# EAGLE schematic 1460-0 (EAGLE 6.0)
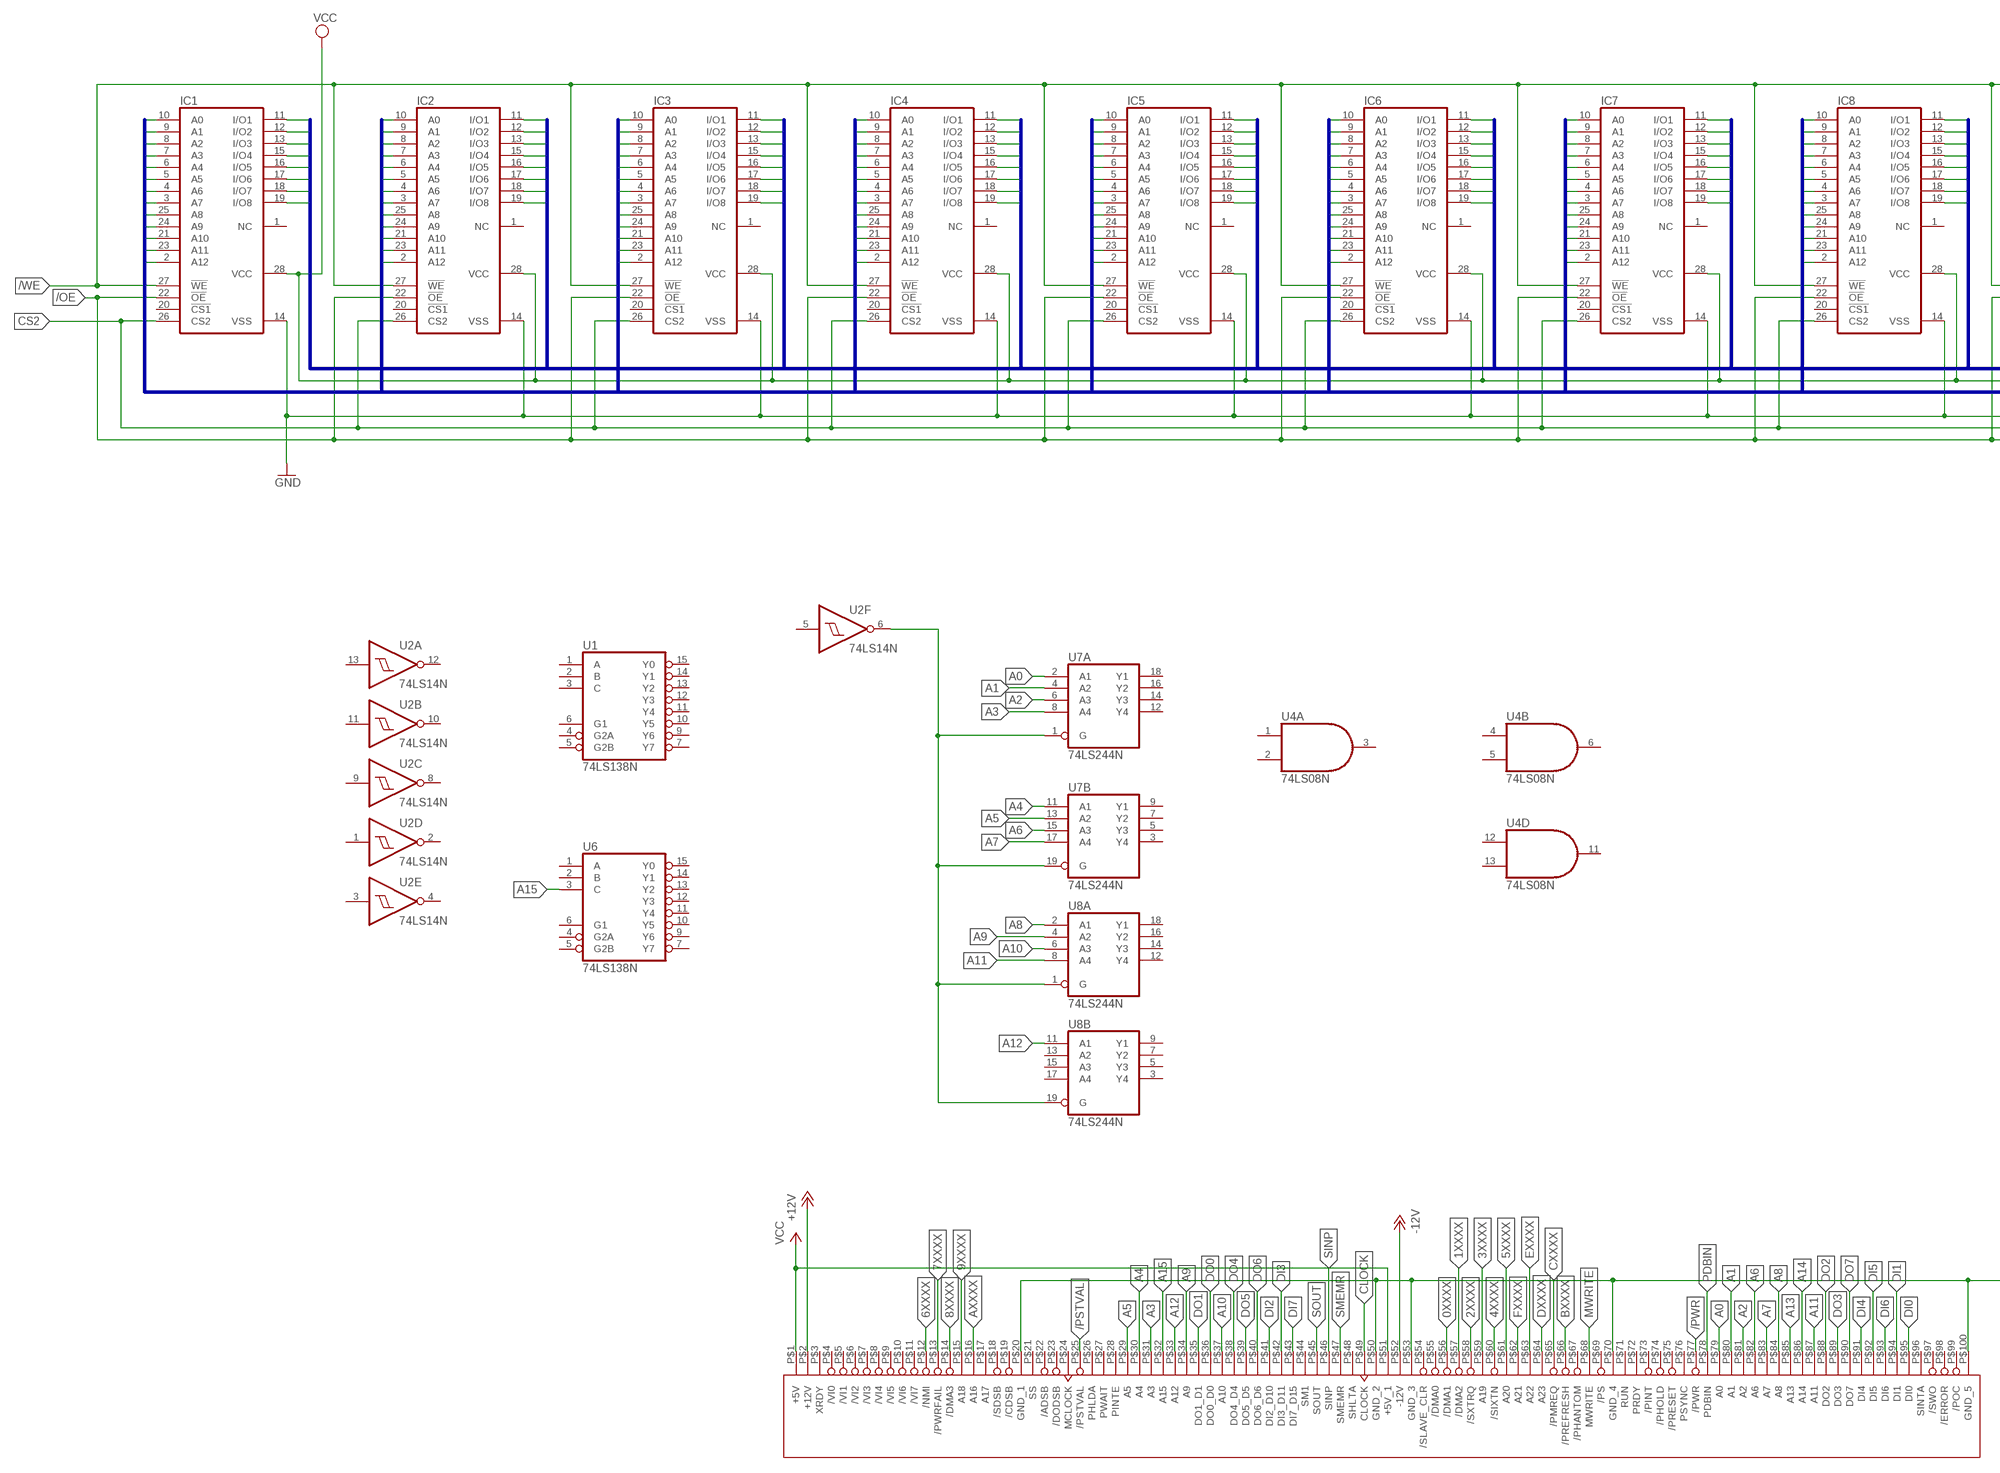
[diagram p0: schematic, sheet 1, part 1 of 2]
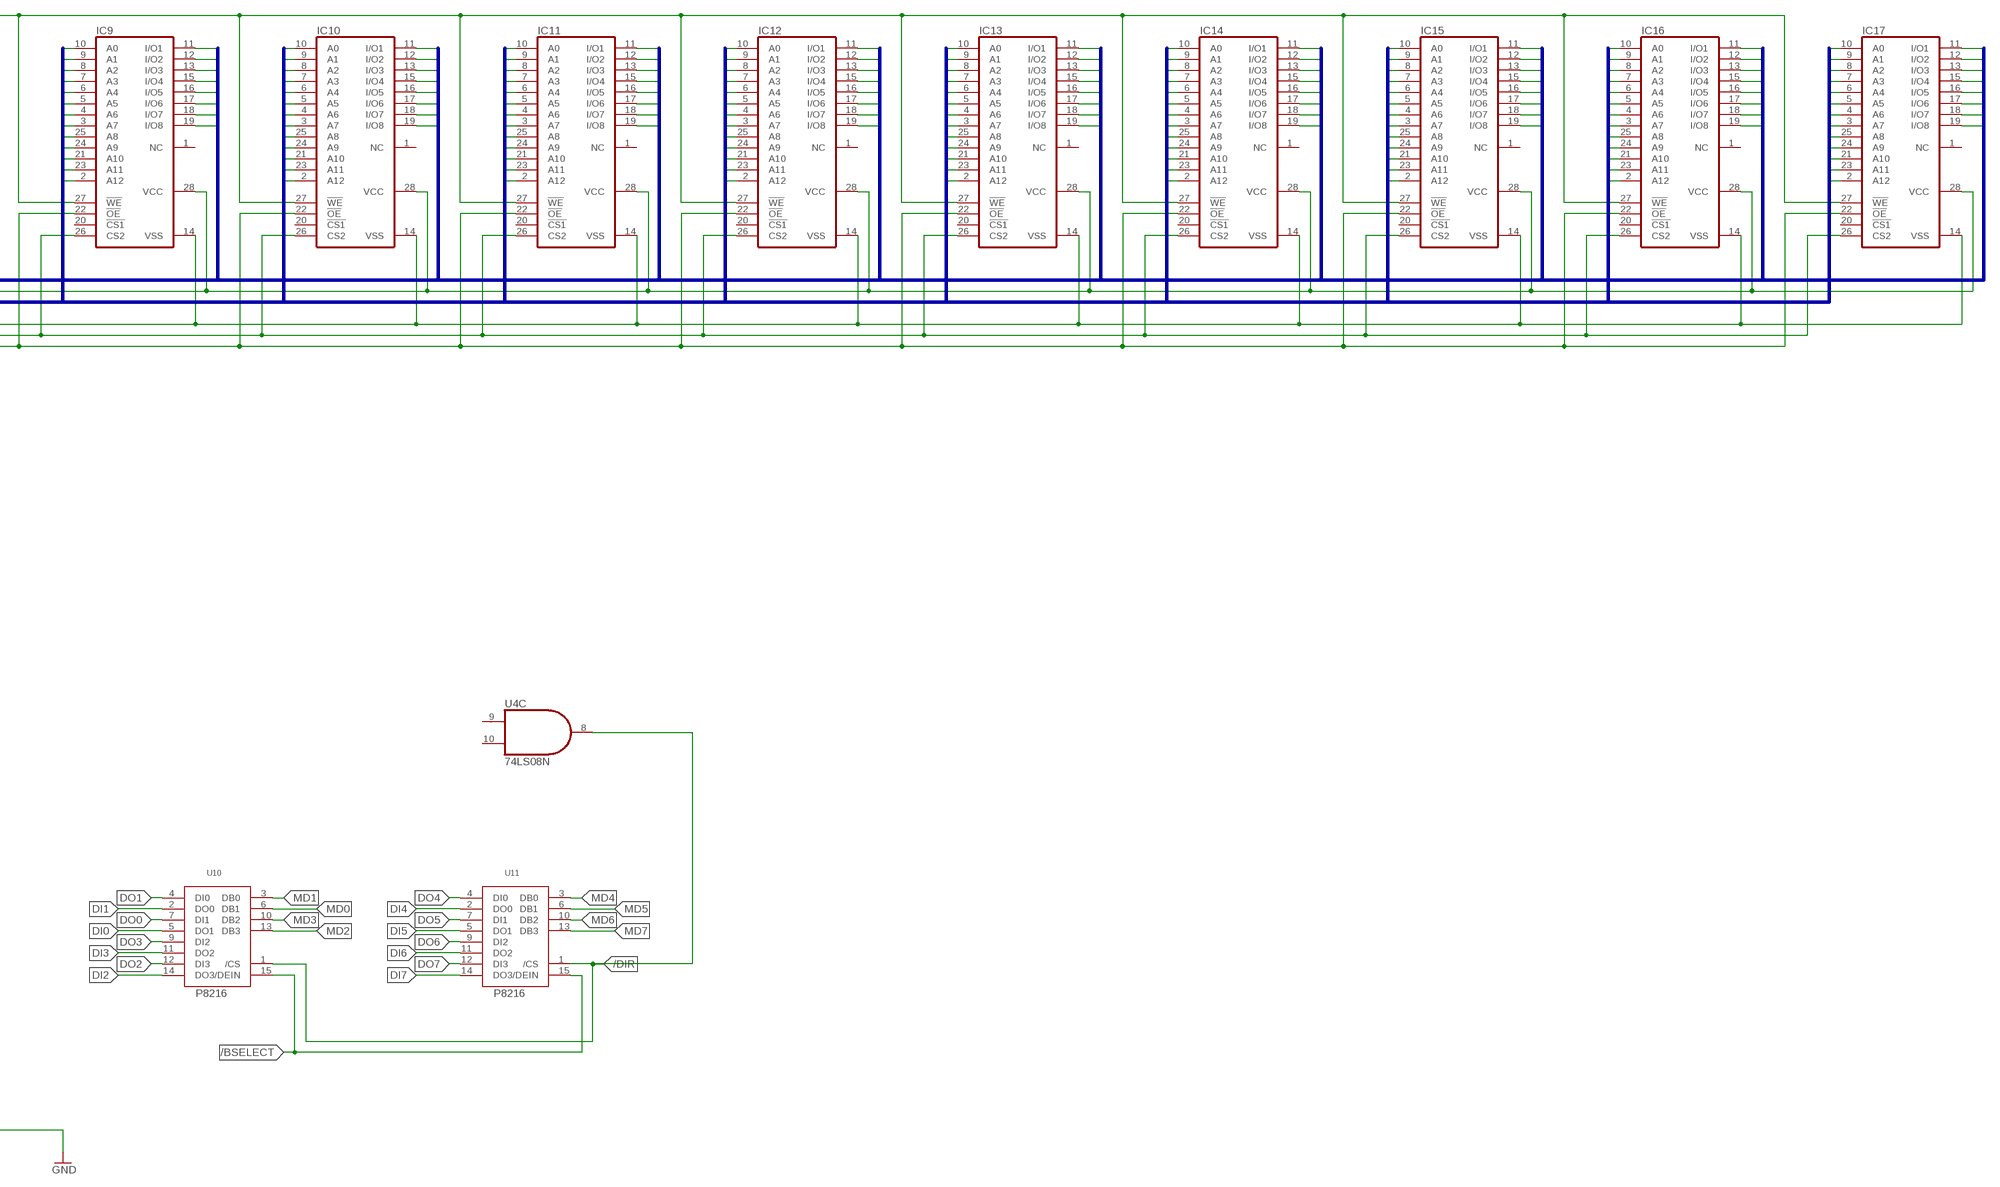
[diagram p1: schematic, sheet 1, part 2 of 2]

## Parts
IC1  6264A  [DIL28-6]
IC2  6264A  [DIL28-6]
IC3  6264A  [DIL28-6]
IC4  6264A  [DIL28-6]
IC5  6264A  [DIL28-6]
IC6  6264A  [DIL28-6]
IC7  6264A  [DIL28-6]
IC8  6264A  [DIL28-6]
IC9  6264A  [DIL28-6]
IC10  6264A  [DIL28-6]
IC11  6264A  [DIL28-6]
IC12  6264A  [DIL28-6]
IC13  6264A  [DIL28-6]
IC14  6264A  [DIL28-6]
IC15  6264A  [DIL28-6]
IC16  6264A  [DIL28-6]
IC17  6264A  [DIL28-6]
U1  74LS138N  [DIL16]
U2  74LS14N  [DIL14]
U4  74LS08N  [DIL14]
U6  74LS138N  [DIL16]
U7  74LS244N  [DIL20]
U8  74LS244N  [DIL20]
U10  P8216  [DIL16]
U11  P8216  [DIL16]
U$1  S100_MALE  [S100_MALE]

## Nets
+12V: U$1.P$2(+12V)
-12V: U$1.P$52(-12V)
/BSELECT: U10.15(/DEIN) U11.15(/DEIN)
/DIR: U4.8(C:O) U10.1(/CS) U11.1(/CS)
/OE: IC1.22(!OE) IC2.22(!OE)
/WE: IC1.27(!WE) IC2.27(!WE)
A0: U7.2(A:A1) U$1.P$79(A0)
A1: U7.4(A:A2) U$1.P$80(A1)
A2: U7.6(A:A3) U$1.P$81(A2)
A3: IC1.7(A3) U7.8(A:A4) U$1.P$31(A3)
A4: IC1.6(A4) U7.11(B:A1) U$1.P$30(A4)
A5: IC1.5(A5) U7.13(B:A2) U$1.P$29(A5)
A6: IC1.4(A6) U7.15(B:A3) U$1.P$82(A6)
A7: IC1.3(A7) U7.17(B:A4) U$1.P$83(A7)
A8: IC1.25(A8) U8.2(A:A1) U$1.P$84(A8)
A9: IC1.24(A9) U8.4(A:A2) U$1.P$34(A9)
A10: IC1.21(A10) U8.6(A:A3) U$1.P$37(A10)
A11: IC1.23(A11) U8.8(A:A4) U$1.P$87(A11)
A12: IC1.2(A12) U8.11(B:A1) U$1.P$33(A12)
A13: U$1.P$85(A13)
A14: U$1.P$86(A14)
A15: U6.3(C) U$1.P$32(A15)
A16: IC2.6(A4)
A17: IC2.7(A3)
A18: IC2.2(A12)
A19: IC2.24(A9)
A20: IC2.21(A10)
A21: IC2.4(A6)
A22: IC2.3(A7)
A23: IC2.25(A8)
A24: IC2.23(A11)
A25: IC2.5(A5)
A26: IC3.6(A4)
A27: IC3.7(A3)
A28: IC3.2(A12)
A29: IC3.24(A9)
A30: IC3.21(A10)
A31: IC3.4(A6)
A32: IC3.3(A7)
A33: IC3.25(A8)
A34: IC3.23(A11)
A35: IC3.5(A5)
A36: IC4.6(A4)
A37: IC4.7(A3)
A38: IC4.2(A12)
A39: IC4.24(A9)
A40: IC4.21(A10)
A41: IC4.4(A6)
A42: IC4.3(A7)
A43: IC4.25(A8)
A44: IC4.23(A11)
A45: IC4.5(A5)
A46: IC5.6(A4)
A47: IC5.7(A3)
A48: IC5.2(A12)
A49: IC5.24(A9)
A50: IC5.21(A10)
A51: IC5.4(A6)
A52: IC5.3(A7)
A53: IC5.25(A8)
A54: IC5.23(A11)
A55: IC5.5(A5)
A56: IC6.6(A4)
A57: IC6.7(A3)
A58: IC6.2(A12)
A59: IC6.24(A9)
A60: IC6.21(A10)
A61: IC6.4(A6)
A62: IC6.3(A7)
A63: IC6.25(A8)
A64: IC6.23(A11)
A65: IC6.5(A5)
A66: IC7.6(A4)
A67: IC7.7(A3)
A68: IC7.2(A12)
A69: IC7.24(A9)
A70: IC7.21(A10)
A71: IC7.4(A6)
A72: IC7.3(A7)
A73: IC7.25(A8)
A74: IC7.23(A11)
A75: IC7.5(A5)
A76: IC8.6(A4)
A77: IC8.7(A3)
A78: IC8.2(A12)
A79: IC8.24(A9)
A80: IC8.21(A10)
A81: IC8.4(A6)
A82: IC8.3(A7)
A83: IC8.25(A8)
A84: IC8.23(A11)
A85: IC8.5(A5)
A86: IC9.6(A4)
A87: IC9.7(A3)
A88: IC9.2(A12)
A89: IC9.24(A9)
A90: IC9.21(A10)
A91: IC9.4(A6)
A92: IC9.3(A7)
A93: IC9.25(A8)
A94: IC9.23(A11)
A95: IC9.5(A5)
A96: IC10.6(A4)
A97: IC10.7(A3)
A98: IC10.2(A12)
A99: IC10.24(A9)
A100: IC10.21(A10)
A101: IC10.4(A6)
A102: IC10.3(A7)
A103: IC10.25(A8)
A104: IC10.23(A11)
A105: IC10.5(A5)
A106: IC11.6(A4)
A107: IC11.7(A3)
A108: IC11.2(A12)
A109: IC11.24(A9)
A110: IC11.21(A10)
A111: IC11.4(A6)
A112: IC11.3(A7)
A113: IC11.25(A8)
A114: IC11.23(A11)
A115: IC11.5(A5)
A116: IC12.6(A4)
A117: IC12.7(A3)
A118: IC12.2(A12)
A119: IC12.24(A9)
A120: IC12.21(A10)
A121: IC12.4(A6)
A122: IC12.3(A7)
A123: IC12.25(A8)
A124: IC12.23(A11)
A125: IC12.5(A5)
A126: IC13.6(A4)
A127: IC13.7(A3)
A128: IC13.2(A12)
A129: IC13.24(A9)
A130: IC13.21(A10)
A131: IC13.4(A6)
A132: IC13.3(A7)
A133: IC13.25(A8)
A134: IC13.23(A11)
A135: IC13.5(A5)
A136: IC14.6(A4)
A137: IC14.7(A3)
A138: IC14.2(A12)
A139: IC14.24(A9)
A140: IC14.21(A10)
A141: IC14.4(A6)
A142: IC14.3(A7)
A143: IC14.25(A8)
A144: IC14.23(A11)
A145: IC14.5(A5)
A146: IC15.6(A4)
A147: IC15.7(A3)
A148: IC15.2(A12)
A149: IC15.24(A9)
A150: IC15.21(A10)
A151: IC15.4(A6)
A152: IC15.3(A7)
A153: IC15.25(A8)
A154: IC15.23(A11)
A155: IC15.5(A5)
A156: IC16.6(A4)
A157: IC16.7(A3)
A158: IC16.2(A12)
A159: IC16.24(A9)
A160: IC16.21(A10)
A161: IC16.4(A6)
A162: IC16.3(A7)
A163: IC16.25(A8)
A164: IC16.23(A11)
A165: IC16.5(A5)
A166: IC17.6(A4)
A167: IC17.7(A3)
A168: IC17.2(A12)
A169: IC17.24(A9)
A170: IC17.21(A10)
A171: IC17.4(A6)
A172: IC17.3(A7)
A173: IC17.25(A8)
A174: IC17.23(A11)
A175: IC17.5(A5)
ADDRESS0: IC1.10(A0)
ADDRESS1: IC1.9(A1)
ADDRESS2: IC1.8(A2)
ADDRESS3: IC2.10(A0)
ADDRESS4: IC2.9(A1)
ADDRESS5: IC2.8(A2)
ADDRESS6: IC3.10(A0)
ADDRESS7: IC3.9(A1)
ADDRESS8: IC3.8(A2)
ADDRESS9: IC4.10(A0)
ADDRESS10: IC4.9(A1)
ADDRESS11: IC4.8(A2)
ADDRESS12: IC5.10(A0)
ADDRESS13: IC5.9(A1)
ADDRESS14: IC5.8(A2)
ADDRESS15: IC6.10(A0)
ADDRESS16: IC6.9(A1)
ADDRESS17: IC6.8(A2)
ADDRESS18: IC7.10(A0)
ADDRESS19: IC7.9(A1)
ADDRESS20: IC7.8(A2)
ADDRESS21: IC8.10(A0)
ADDRESS22: IC8.9(A1)
ADDRESS23: IC8.8(A2)
ADDRESS24: IC9.10(A0)
ADDRESS25: IC9.9(A1)
ADDRESS26: IC9.8(A2)
ADDRESS27: IC10.10(A0)
ADDRESS28: IC10.9(A1)
ADDRESS29: IC10.8(A2)
ADDRESS30: IC11.10(A0)
ADDRESS31: IC11.9(A1)
ADDRESS32: IC11.8(A2)
ADDRESS33: IC12.10(A0)
ADDRESS34: IC12.9(A1)
ADDRESS35: IC12.8(A2)
ADDRESS36: IC13.10(A0)
ADDRESS37: IC13.9(A1)
ADDRESS38: IC13.8(A2)
ADDRESS39: IC14.10(A0)
ADDRESS40: IC14.9(A1)
ADDRESS41: IC14.8(A2)
ADDRESS42: IC15.10(A0)
ADDRESS43: IC15.9(A1)
ADDRESS44: IC15.8(A2)
ADDRESS45: IC16.10(A0)
ADDRESS46: IC16.9(A1)
ADDRESS47: IC16.8(A2)
ADDRESS48: IC17.10(A0)
ADDRESS49: IC17.9(A1)
ADDRESS50: IC17.8(A2)
AEN: U2.6(F:O) U7.1(A:G) U7.19(B:G) U8.1(A:G) U8.19(B:G)
CS2: IC1.26(CS2) IC2.26(CS2)
DATA0: IC1.11(I/O1)
DATA1: IC1.12(I/O2)
DATA2: IC1.13(I/O3)
DATA3: IC1.15(I/O4)
DATA4: IC1.16(I/O5)
DATA5: IC1.17(I/O6)
DATA6: IC1.18(I/O7)
DATA7: IC1.19(I/O8)
DATA8: IC2.19(I/O8)
DATA9: IC2.11(I/O1)
DATA10: IC2.12(I/O2)
DATA11: IC2.13(I/O3)
DATA12: IC2.15(I/O4)
DATA13: IC2.16(I/O5)
DATA14: IC2.17(I/O6)
DATA15: IC2.18(I/O7)
DATA16: IC3.19(I/O8)
DATA17: IC3.11(I/O1)
DATA18: IC3.12(I/O2)
DATA19: IC3.13(I/O3)
DATA20: IC3.15(I/O4)
DATA21: IC3.16(I/O5)
DATA22: IC3.17(I/O6)
DATA23: IC3.18(I/O7)
DATA24: IC4.19(I/O8)
DATA25: IC4.11(I/O1)
DATA26: IC4.12(I/O2)
DATA27: IC4.13(I/O3)
DATA28: IC4.15(I/O4)
DATA29: IC4.16(I/O5)
DATA30: IC4.17(I/O6)
DATA31: IC4.18(I/O7)
DATA32: IC5.19(I/O8)
DATA33: IC5.11(I/O1)
DATA34: IC5.12(I/O2)
DATA35: IC5.13(I/O3)
DATA36: IC5.15(I/O4)
DATA37: IC5.16(I/O5)
DATA38: IC5.17(I/O6)
DATA39: IC5.18(I/O7)
DATA40: IC6.19(I/O8)
DATA41: IC6.11(I/O1)
DATA42: IC6.12(I/O2)
DATA43: IC6.13(I/O3)
DATA44: IC6.15(I/O4)
DATA45: IC6.16(I/O5)
DATA46: IC6.17(I/O6)
DATA47: IC6.18(I/O7)
DATA48: IC7.19(I/O8)
DATA49: IC7.11(I/O1)
DATA50: IC7.12(I/O2)
DATA51: IC7.13(I/O3)
DATA52: IC7.15(I/O4)
DATA53: IC7.16(I/O5)
DATA54: IC7.17(I/O6)
DATA55: IC7.18(I/O7)
DATA56: IC8.19(I/O8)
DATA57: IC8.11(I/O1)
DATA58: IC8.12(I/O2)
DATA59: IC8.13(I/O3)
DATA60: IC8.15(I/O4)
DATA61: IC8.16(I/O5)
DATA62: IC8.17(I/O6)
DATA63: IC8.18(I/O7)
DATA64: IC9.19(I/O8)
DATA65: IC9.11(I/O1)
DATA66: IC9.12(I/O2)
DATA67: IC9.13(I/O3)
DATA68: IC9.15(I/O4)
DATA69: IC9.16(I/O5)
DATA70: IC9.17(I/O6)
DATA71: IC9.18(I/O7)
DATA72: IC10.19(I/O8)
DATA73: IC10.11(I/O1)
DATA74: IC10.12(I/O2)
DATA75: IC10.13(I/O3)
DATA76: IC10.15(I/O4)
DATA77: IC10.16(I/O5)
DATA78: IC10.17(I/O6)
DATA79: IC10.18(I/O7)
DATA80: IC11.19(I/O8)
DATA81: IC11.11(I/O1)
DATA82: IC11.12(I/O2)
DATA83: IC11.13(I/O3)
DATA84: IC11.15(I/O4)
DATA85: IC11.16(I/O5)
DATA86: IC11.17(I/O6)
DATA87: IC11.18(I/O7)
DATA88: IC12.19(I/O8)
DATA89: IC12.11(I/O1)
DATA90: IC12.12(I/O2)
DATA91: IC12.13(I/O3)
DATA92: IC12.15(I/O4)
DATA93: IC12.16(I/O5)
DATA94: IC12.17(I/O6)
DATA95: IC12.18(I/O7)
DATA96: IC13.19(I/O8)
DATA97: IC13.11(I/O1)
DATA98: IC13.12(I/O2)
DATA99: IC13.13(I/O3)
DATA100: IC13.15(I/O4)
DATA101: IC13.16(I/O5)
DATA102: IC13.17(I/O6)
DATA103: IC13.18(I/O7)
DATA104: IC14.19(I/O8)
DATA105: IC14.11(I/O1)
DATA106: IC14.12(I/O2)
DATA107: IC14.13(I/O3)
DATA108: IC14.15(I/O4)
DATA109: IC14.16(I/O5)
DATA110: IC14.17(I/O6)
DATA111: IC14.18(I/O7)
DATA112: IC15.19(I/O8)
DATA113: IC15.11(I/O1)
DATA114: IC15.12(I/O2)
DATA115: IC15.13(I/O3)
DATA116: IC15.15(I/O4)
DATA117: IC15.16(I/O5)
DATA118: IC15.17(I/O6)
DATA119: IC15.18(I/O7)
DATA120: IC16.19(I/O8)
DATA121: IC16.11(I/O1)
DATA122: IC16.12(I/O2)
DATA123: IC16.13(I/O3)
DATA124: IC16.15(I/O4)
DATA125: IC16.16(I/O5)
DATA126: IC16.17(I/O6)
DATA127: IC16.18(I/O7)
DATA128: IC17.19(I/O8)
DATA129: IC17.11(I/O1)
DATA130: IC17.12(I/O2)
DATA131: IC17.13(I/O3)
DATA132: IC17.15(I/O4)
DATA133: IC17.16(I/O5)
DATA134: IC17.17(I/O6)
DATA135: IC17.18(I/O7)
DI0: U10.5(DO1) U$1.P$95(DI0)
DI1: U10.2(DO0) U$1.P$94(DI1)
DI2: U10.14(DO3) U$1.P$41(DI2_D10)
DI3: U10.11(DO2) U$1.P$42(DI3_D11)
DI4: U11.2(DO0) U$1.P$91(DI4)
DI5: U11.5(DO1) U$1.P$92(DI5)
DI6: U11.11(DO2) U$1.P$93(DI6)
DI7: U11.14(DO3) U$1.P$43(DI7_D15)
DO0: U10.7(DI1) U$1.P$36(DO0_D0)
DO1: U10.4(DI0) U$1.P$35(DO1_D1)
DO2: U10.12(DI3) U$1.P$88(DO2)
DO3: U10.9(DI2) U$1.P$89(DO3)
DO4: U11.4(DI0) U$1.P$38(DO4_D4)
DO5: U11.7(DI1) U$1.P$39(DO5_D5)
DO6: U11.9(DI2) U$1.P$40(DO6_D6)
DO7: U11.12(DI3) U$1.P$90(DO7)
GND: IC1.14(VSS) IC2.14(VSS) U$1.P$20(GND_1) U$1.P$50(GND_2) U$1.P$53(GND_3) U$1.P$70(GND_4) U$1.P$100(GND_5)
MD0: U10.6(DB1)
MD1: U10.3(DB0)
MD2: U10.13(DB3)
MD3: U10.10(DB2)
MD4: U11.3(DB0)
MD5: U11.6(DB1)
MD6: U11.10(DB2)
MD7: U11.13(DB3)
MWRITE: U$1.P$68(MWRITE)
N$4: IC3.28(VCC)
N$5: IC3.14(VSS)
N$6: IC3.26(CS2)
N$8: IC3.27(!WE)
N$12: IC3.22(!OE)
N$13: IC4.28(VCC)
N$14: IC4.14(VSS)
N$15: IC4.26(CS2)
N$17: IC4.27(!WE)
N$18: IC4.22(!OE)
N$19: IC5.28(VCC)
N$20: IC5.14(VSS)
N$21: IC5.26(CS2)
N$23: IC5.27(!WE)
N$24: IC5.22(!OE)
N$25: IC6.28(VCC)
N$26: IC6.14(VSS)
N$27: IC6.26(CS2)
N$29: IC6.27(!WE)
N$30: IC6.22(!OE)
N$31: IC7.28(VCC)
N$32: IC7.14(VSS)
N$33: IC7.26(CS2)
N$35: IC7.27(!WE)
N$36: IC7.22(!OE)
N$37: IC8.28(VCC)
N$38: IC8.14(VSS)
N$39: IC8.26(CS2)
N$41: IC8.27(!WE)
N$42: IC8.22(!OE)
N$43: IC9.28(VCC)
N$44: IC9.14(VSS)
N$45: IC9.26(CS2)
N$47: IC9.27(!WE)
N$48: IC9.22(!OE)
N$49: IC10.28(VCC)
N$50: IC10.14(VSS)
N$51: IC10.26(CS2)
N$53: IC10.27(!WE)
N$54: IC10.22(!OE)
N$55: IC11.28(VCC)
N$56: IC11.14(VSS)
N$57: IC11.26(CS2)
N$59: IC11.27(!WE)
N$60: IC11.22(!OE)
N$61: IC12.28(VCC)
N$62: IC12.14(VSS)
N$63: IC12.26(CS2)
N$65: IC12.27(!WE)
N$66: IC12.22(!OE)
N$67: IC13.28(VCC)
N$68: IC13.14(VSS)
N$69: IC13.26(CS2)
N$71: IC13.27(!WE)
N$72: IC13.22(!OE)
N$73: IC14.28(VCC)
N$74: IC14.14(VSS)
N$75: IC14.26(CS2)
N$77: IC14.27(!WE)
N$78: IC14.22(!OE)
N$79: IC15.28(VCC)
N$80: IC15.14(VSS)
N$81: IC15.26(CS2)
N$83: IC15.27(!WE)
N$84: IC15.22(!OE)
N$85: IC16.28(VCC)
N$86: IC16.14(VSS)
N$87: IC16.26(CS2)
N$89: IC16.27(!WE)
N$90: IC16.22(!OE)
N$91: IC17.28(VCC)
N$92: IC17.14(VSS)
N$93: IC17.26(CS2)
N$95: IC17.27(!WE)
N$96: IC17.22(!OE)
SINP: U$1.P$46(SINP)
SMEMR: U$1.P$47(SMEMR)
SOUT: U$1.P$45(SOUT)
VCC: IC1.28(VCC) IC2.28(VCC) U$1.P$1(+5V) U$1.P$51(+5V_1)
Unconnected: IC1.1(NC) IC1.20(!CS1) IC2.1(NC) IC2.20(!CS1) IC3.1(NC) IC3.20(!CS1) IC4.1(NC) IC4.20(!CS1) IC5.1(NC) IC5.20(!CS1) IC6.1(NC) IC6.20(!CS1) IC7.1(NC) IC7.20(!CS1) IC8.1(NC) IC8.20(!CS1) IC9.1(NC) IC9.20(!CS1) IC10.1(NC) IC10.20(!CS1) IC11.1(NC) IC11.20(!CS1) IC12.1(NC) IC12.20(!CS1) IC13.1(NC) IC13.20(!CS1) IC14.1(NC) IC14.20(!CS1) IC15.1(NC) IC15.20(!CS1) IC16.1(NC) IC16.20(!CS1) IC17.1(NC) IC17.20(!CS1) U1.1(A) U1.2(B) U1.3(C) U1.4(G2A) U1.5(G2B) U1.6(G1) U1.7(Y7) U1.9(Y6) U1.10(Y5) U1.11(Y4) U1.12(Y3) U1.13(Y2) U1.14(Y1) U1.15(Y0) U2.1(D:I) U2.2(D:O) U2.3(E:I) U2.4(E:O) U2.5(F:I) U2.8(C:O) U2.9(C:I) U2.10(B:O) U2.11(B:I) U2.12(A:O) U2.13(A:I) U4.1(A:I0) U4.2(A:I1) U4.3(A:O) U4.4(B:I0) U4.5(B:I1) U4.6(B:O) U4.9(C:I0) U4.10(C:I1) U4.11(D:O) U4.12(D:I0) U4.13(D:I1) U6.1(A) U6.2(B) U6.4(G2A) U6.5(G2B) U6.6(G1) U6.7(Y7) U6.9(Y6) U6.10(Y5) U6.11(Y4) U6.12(Y3) U6.13(Y2) U6.14(Y1) U6.15(Y0) U7.3(B:Y4) U7.5(B:Y3) U7.7(B:Y2) U7.9(B:Y1) U7.12(A:Y4) U7.14(A:Y3) U7.16(A:Y2) U7.18(A:Y1) U8.3(B:Y4) U8.5(B:Y3) U8.7(B:Y2) U8.9(B:Y1) U8.12(A:Y4) U8.13(B:A2) U8.14(A:Y3) U8.15(B:A3) U8.16(A:Y2) U8.17(B:A4) U8.18(A:Y1) U$1.P$3(XRDY) U$1.P$4(/VI0) U$1.P$5(/VI1) U$1.P$6(/VI2) U$1.P$7(/VI3) U$1.P$8(/VI4) U$1.P$9(/VI5) U$1.P$10(/VI6) U$1.P$11(/VI7) U$1.P$12(/NMI) U$1.P$13(/PWRFAIL) U$1.P$14(/DMA3) U$1.P$15(A18) U$1.P$16(A16) U$1.P$17(A17) U$1.P$18(/SDSB) U$1.P$19(/CDSB) U$1.P$21(SS) U$1.P$22(/ADSB) U$1.P$23(/DODSB) U$1.P$24(MCLOCK) U$1.P$25(/PSTVAL) U$1.P$26(PHLDA) U$1.P$27(PWAIT) U$1.P$28(PINTE) U$1.P$44(SM1) U$1.P$48(SHLTA) U$1.P$49(CLOCK) U$1.P$54(/SLAVE_CLR) U$1.P$55(/DMA0) U$1.P$56(/DMA1) U$1.P$57(/DMA2) U$1.P$58(/SXTRQ) U$1.P$59(A19) U$1.P$60(/SIXTN) U$1.P$61(A20) U$1.P$62(A21) U$1.P$63(A22) U$1.P$64(A23) U$1.P$65(/PMREQ) U$1.P$66(/PREFRESH) U$1.P$67(/PHANTOM) U$1.P$69(/PS) U$1.P$71(RUN) U$1.P$72(PRDY) U$1.P$73(/PINT) U$1.P$74(/PHOLD) U$1.P$75(/PRESET) U$1.P$76(PSYNC) U$1.P$77(/PWR) U$1.P$78(PDBIN) U$1.P$96(SINTA) U$1.P$97(/SWO) U$1.P$98(/ERROR) U$1.P$99(/POC)

## Buses
DATA[0..7]
A[0..12]

## Power pins joined to a net without a drawn wire
GND: U1.8(GND) U2.7(P:GND) U4.7(P:GND) U6.8(GND) U7.10(P:GND) U8.10(P:GND) U10.8(GND) U11.8(GND)
VCC: U1.16(VCC) U2.14(P:VCC) U4.14(P:VCC) U6.16(VCC) U7.20(P:VCC) U8.20(P:VCC) U10.16(VCC) U11.16(VCC)

## Library data of the parts
IC1-IC17 = memory-hitachi:6264A: MEMORY; OC_FARNELL: 283605; OC_NEWARK: unknown
U1 U6 = 74xx-us:74*138: 3-line to 8-line DECODER/DEMULTIPLEXER
U2 = 74xx-us:74*14: Hex schmitt trigger INVERTER
U4 = 74xx-us:74*08: Quad 2-input AND gate
U7 U8 = 74xx-us:74*244: Octal BUFFER and LINE DRIVER, 3-state
U10 U11 = s100:P8216
U$1 = s100:S100_MALE